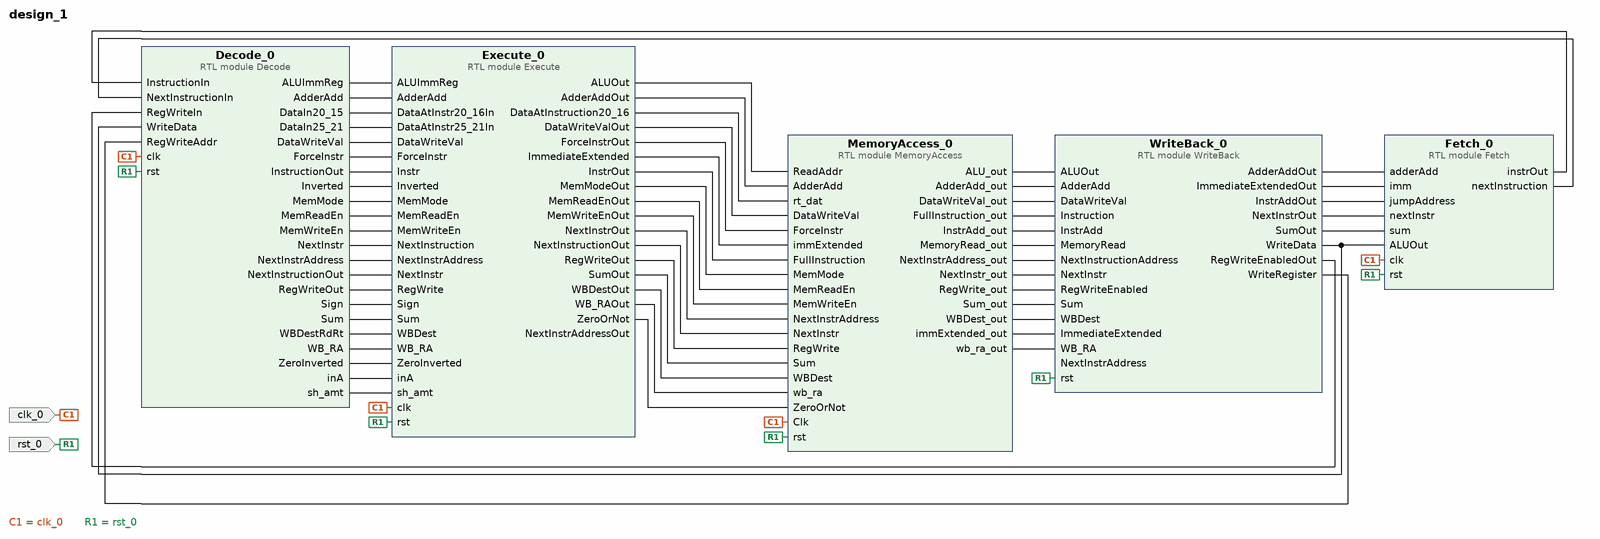
[diagram p0: block diagram of the top level]
# Vivado block design design_1, xc7a200tfbg676-2, Vivado 2024.1
create_bd_design design_1

create_bd_port -dir I -type clk clk_0
create_bd_port -dir I -type rst rst_0

create_bd_cell -type module -reference Execute Execute_0
create_bd_cell -type module -reference Decode Decode_0
create_bd_cell -type module -reference MemoryAccess MemoryAccess_0
create_bd_cell -type module -reference WriteBack WriteBack_0
create_bd_cell -type module -reference Fetch Fetch_0

# ---- connections ----

connect_bd_net [get_bd_pins Decode_0/ALUImmReg] [get_bd_pins Execute_0/ALUImmReg]
connect_bd_net [get_bd_pins Decode_0/AdderAdd] [get_bd_pins Execute_0/AdderAdd]
connect_bd_net [get_bd_pins Decode_0/DataIn20_15] [get_bd_pins Execute_0/DataAtInstr20_16In]
connect_bd_net [get_bd_pins Decode_0/DataIn25_21] [get_bd_pins Execute_0/DataAtInstr25_21In]
connect_bd_net [get_bd_pins Decode_0/DataWriteVal] [get_bd_pins Execute_0/DataWriteVal]
connect_bd_net [get_bd_pins Decode_0/ForceInstr] [get_bd_pins Execute_0/ForceInstr]
connect_bd_net [get_bd_pins Decode_0/InstructionOut] [get_bd_pins Execute_0/Instr]
connect_bd_net [get_bd_pins Decode_0/Inverted] [get_bd_pins Execute_0/Inverted]
connect_bd_net [get_bd_pins Decode_0/MemMode] [get_bd_pins Execute_0/MemMode]
connect_bd_net [get_bd_pins Decode_0/MemReadEn] [get_bd_pins Execute_0/MemReadEn]
connect_bd_net [get_bd_pins Decode_0/MemWriteEn] [get_bd_pins Execute_0/MemWriteEn]
connect_bd_net [get_bd_pins Decode_0/NextInstr] [get_bd_pins Execute_0/NextInstruction]
connect_bd_net [get_bd_pins Decode_0/NextInstrAddress] [get_bd_pins Execute_0/NextInstrAddress]
connect_bd_net [get_bd_pins Decode_0/NextInstructionOut] [get_bd_pins Execute_0/NextInstr]
connect_bd_net [get_bd_pins Decode_0/RegWriteOut] [get_bd_pins Execute_0/RegWrite]
connect_bd_net [get_bd_pins Decode_0/Sign] [get_bd_pins Execute_0/Sign]
connect_bd_net [get_bd_pins Decode_0/Sum] [get_bd_pins Execute_0/Sum]
connect_bd_net [get_bd_pins Decode_0/WBDestRdRt] [get_bd_pins Execute_0/WBDest]
connect_bd_net [get_bd_pins Decode_0/WB_RA] [get_bd_pins Execute_0/WB_RA]
connect_bd_net [get_bd_pins Decode_0/ZeroInverted] [get_bd_pins Execute_0/ZeroInverted]
connect_bd_net [get_bd_pins Decode_0/inA] [get_bd_pins Execute_0/inA]
connect_bd_net [get_bd_pins Decode_0/sh_amt] [get_bd_pins Execute_0/sh_amt]
connect_bd_net [get_bd_pins Execute_0/ALUOut] [get_bd_pins MemoryAccess_0/ReadAddr]
connect_bd_net [get_bd_pins Execute_0/AdderAddOut] [get_bd_pins MemoryAccess_0/AdderAdd]
connect_bd_net [get_bd_pins Execute_0/DataAtInstruction20_16] [get_bd_pins MemoryAccess_0/rt_dat]
connect_bd_net [get_bd_pins Execute_0/DataWriteValOut] [get_bd_pins MemoryAccess_0/DataWriteVal]
connect_bd_net [get_bd_pins Execute_0/ForceInstrOut] [get_bd_pins MemoryAccess_0/ForceInstr]
connect_bd_net [get_bd_pins Execute_0/ImmediateExtended] [get_bd_pins MemoryAccess_0/immExtended]
connect_bd_net [get_bd_pins Execute_0/InstrOut] [get_bd_pins MemoryAccess_0/FullInstruction]
connect_bd_net [get_bd_pins Execute_0/MemModeOut] [get_bd_pins MemoryAccess_0/MemMode]
connect_bd_net [get_bd_pins Execute_0/MemReadEnOut] [get_bd_pins MemoryAccess_0/MemReadEn]
connect_bd_net [get_bd_pins Execute_0/MemWriteEnOut] [get_bd_pins MemoryAccess_0/MemWriteEn]
# net Execute_0_NextInstrAddressOut has one end: Execute_0/NextInstrAddressOut
connect_bd_net [get_bd_pins Execute_0/NextInstrOut] [get_bd_pins MemoryAccess_0/NextInstrAddress]
connect_bd_net [get_bd_pins Execute_0/NextInstructionOut] [get_bd_pins MemoryAccess_0/NextInstr]
connect_bd_net [get_bd_pins Execute_0/RegWriteOut] [get_bd_pins MemoryAccess_0/RegWrite]
connect_bd_net [get_bd_pins Execute_0/SumOut] [get_bd_pins MemoryAccess_0/Sum]
connect_bd_net [get_bd_pins Execute_0/WBDestOut] [get_bd_pins MemoryAccess_0/WBDest]
connect_bd_net [get_bd_pins Execute_0/WB_RAOut] [get_bd_pins MemoryAccess_0/wb_ra]
connect_bd_net [get_bd_pins Execute_0/ZeroOrNot] [get_bd_pins MemoryAccess_0/ZeroOrNot]
connect_bd_net [get_bd_pins Fetch_0/instrOut] [get_bd_pins Decode_0/InstructionIn]
connect_bd_net [get_bd_pins Fetch_0/nextInstruction] [get_bd_pins Decode_0/NextInstructionIn]
connect_bd_net [get_bd_pins MemoryAccess_0/ALU_out] [get_bd_pins WriteBack_0/ALUOut]
connect_bd_net [get_bd_pins MemoryAccess_0/AdderAdd_out] [get_bd_pins WriteBack_0/AdderAdd]
connect_bd_net [get_bd_pins MemoryAccess_0/DataWriteVal_out] [get_bd_pins WriteBack_0/DataWriteVal]
connect_bd_net [get_bd_pins MemoryAccess_0/FullInstruction_out] [get_bd_pins WriteBack_0/Instruction]
connect_bd_net [get_bd_pins MemoryAccess_0/InstrAdd_out] [get_bd_pins WriteBack_0/InstrAdd]
connect_bd_net [get_bd_pins MemoryAccess_0/MemoryRead_out] [get_bd_pins WriteBack_0/MemoryRead]
# net MemoryAccess_0_NextInstrAddressFlag_out has one end: WriteBack_0/NextInstrAddress
connect_bd_net [get_bd_pins MemoryAccess_0/NextInstrAddress_out] [get_bd_pins WriteBack_0/NextInstructionAddress]
connect_bd_net [get_bd_pins MemoryAccess_0/NextInstr_out] [get_bd_pins WriteBack_0/NextInstr]
connect_bd_net [get_bd_pins MemoryAccess_0/RegWrite_out] [get_bd_pins WriteBack_0/RegWriteEnabled]
connect_bd_net [get_bd_pins MemoryAccess_0/Sum_out] [get_bd_pins WriteBack_0/Sum]
connect_bd_net [get_bd_pins MemoryAccess_0/WBDest_out] [get_bd_pins WriteBack_0/WBDest]
connect_bd_net [get_bd_pins MemoryAccess_0/immExtended_out] [get_bd_pins WriteBack_0/ImmediateExtended]
connect_bd_net [get_bd_pins MemoryAccess_0/wb_ra_out] [get_bd_pins WriteBack_0/WB_RA]
connect_bd_net [get_bd_pins WriteBack_0/AdderAddOut] [get_bd_pins Fetch_0/adderAdd]
connect_bd_net [get_bd_pins WriteBack_0/ImmediateExtendedOut] [get_bd_pins Fetch_0/imm]
connect_bd_net [get_bd_pins WriteBack_0/InstrAddOut] [get_bd_pins Fetch_0/jumpAddress]
connect_bd_net [get_bd_pins WriteBack_0/NextInstrOut] [get_bd_pins Fetch_0/nextInstr]
connect_bd_net [get_bd_pins WriteBack_0/RegWriteEnabledOut] [get_bd_pins Decode_0/RegWriteIn]
connect_bd_net [get_bd_pins WriteBack_0/SumOut] [get_bd_pins Fetch_0/sum]
connect_bd_net [get_bd_pins WriteBack_0/WriteData] [get_bd_pins Fetch_0/ALUOut] [get_bd_pins Decode_0/WriteData]
connect_bd_net [get_bd_pins WriteBack_0/WriteRegister] [get_bd_pins Decode_0/RegWriteAddr]
connect_bd_net -net clk_0_1 [get_bd_ports clk_0] \
  [get_bd_pins Fetch_0/clk] [get_bd_pins Decode_0/clk] [get_bd_pins Execute_0/clk] [get_bd_pins MemoryAccess_0/Clk]
connect_bd_net -net rst_0_1 [get_bd_ports rst_0] \
  [get_bd_pins Fetch_0/rst] [get_bd_pins Decode_0/rst] [get_bd_pins Execute_0/rst] [get_bd_pins MemoryAccess_0/rst] \
  [get_bd_pins WriteBack_0/rst]

validate_bd_design
save_bd_design
